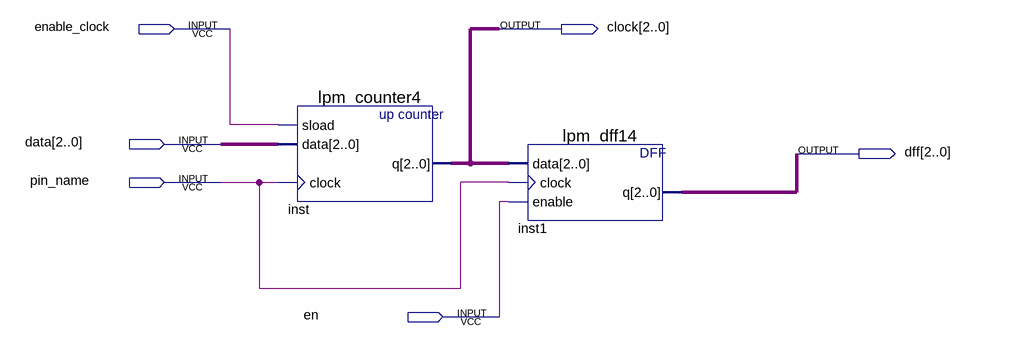
[diagram p0: schematic sheet]
// Quartus schematic test.bdf as structural Verilog: 2 symbols, 6 pins
module test (
  input  enable_clock,
  input  [2:0] data,
  input  pin_name,
  input  en,
  output [2:0] clock,
  output [2:0] dff
);

  lpm_counter4 inst (.sload(enable_clock), .data(data), .clock(pin_name), .q(clock));
  lpm_dff14 inst1 (.data(clock), .clock(pin_name), .enable(en), .q(dff));
endmodule
